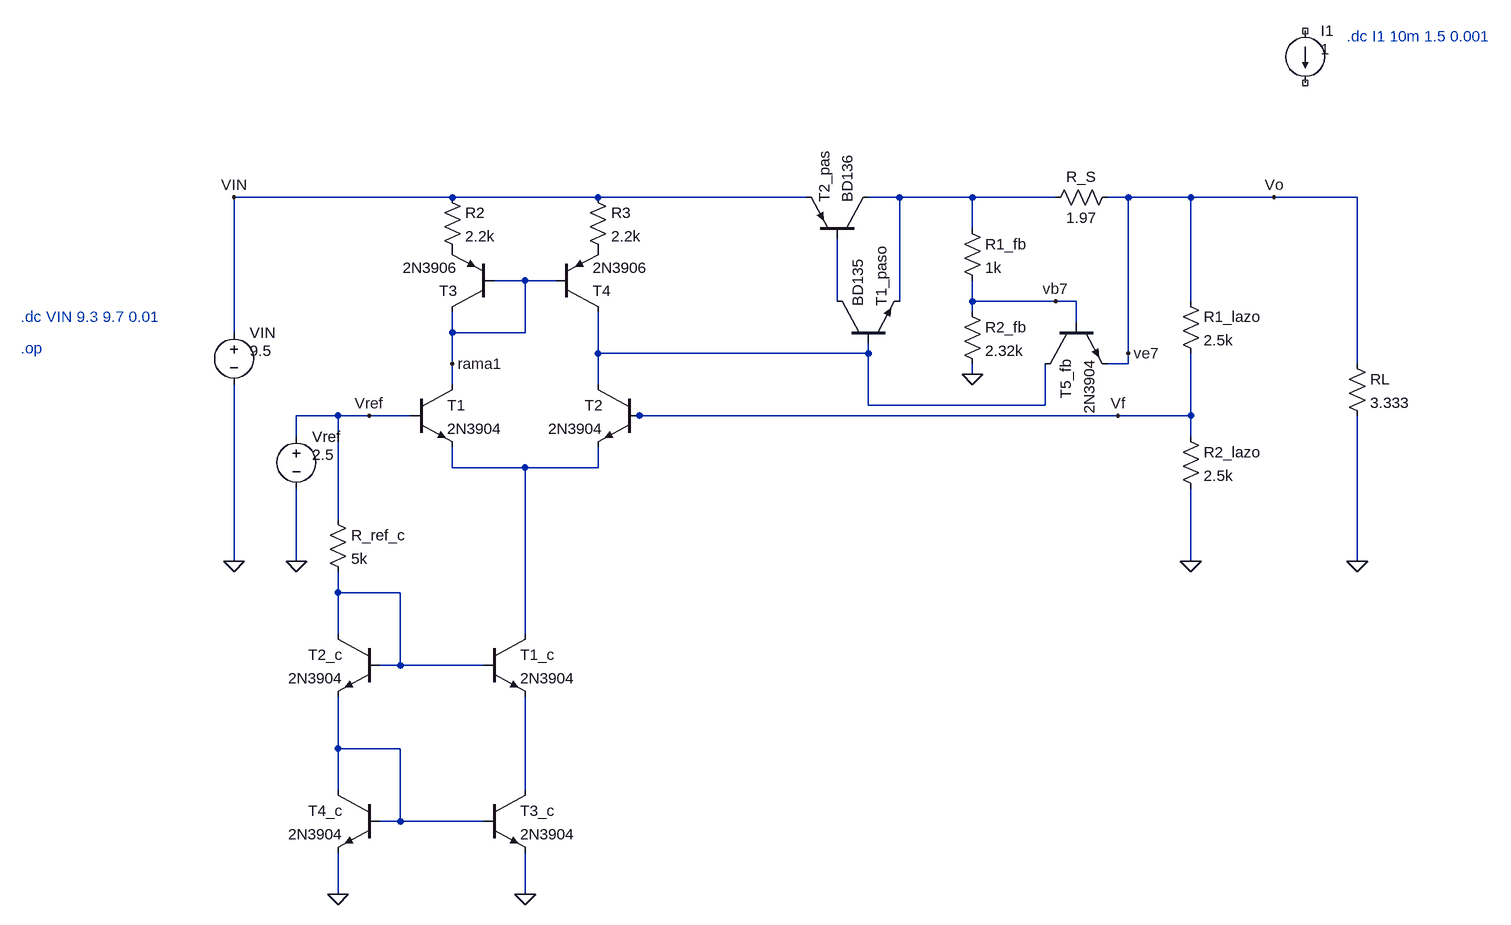
[diagram p0: schematic Circuito_grupo4.asc]
Circuito_grupo4.asc, the LTspice schematic file:
Version 4
SHEET 1 2316 1060
WIRE 96 -32 -240 -32
WIRE 320 -32 96 -32
WIRE 640 -32 320 -32
WIRE 784 -32 736 -32
WIRE 896 -32 784 -32
WIRE 1024 -32 896 -32
WIRE 1136 -32 1104 -32
WIRE 1232 -32 1136 -32
WIRE 1360 -32 1232 -32
WIRE 1488 -32 1360 -32
WIRE 896 16 896 -32
WIRE 208 96 160 96
WIRE 256 96 208 96
WIRE 688 128 688 32
WIRE 784 128 784 -32
WIRE 896 128 896 96
WIRE 1024 128 896 128
WIRE 1056 128 1024 128
WIRE 1232 128 1232 -32
WIRE 896 144 896 128
WIRE 1056 160 1056 128
WIRE -240 176 -240 -32
WIRE 96 176 96 144
WIRE 208 176 208 96
WIRE 208 176 96 176
WIRE 320 208 320 144
WIRE 736 208 736 192
WIRE 736 208 320 208
WIRE 1136 208 1136 -32
WIRE 96 224 96 176
WIRE 1136 224 1136 208
WIRE 1136 224 1104 224
WIRE 1488 224 1488 -32
WIRE 896 240 896 224
WIRE 96 256 96 224
WIRE 320 256 320 208
WIRE 736 288 736 208
WIRE 1008 288 1008 224
WIRE 1008 288 736 288
WIRE -80 304 -144 304
WIRE -32 304 -80 304
WIRE 32 304 -32 304
WIRE 384 304 368 304
WIRE 1120 304 384 304
WIRE 1232 304 1232 208
WIRE 1232 304 1120 304
WIRE -144 336 -144 304
WIRE 1232 336 1232 304
WIRE 96 384 96 352
WIRE 208 384 96 384
WIRE 320 384 320 352
WIRE 320 384 208 384
WIRE -80 464 -80 304
WIRE -240 528 -240 256
WIRE -144 528 -144 416
WIRE 1232 528 1232 416
WIRE 1488 528 1488 304
WIRE -80 576 -80 544
WIRE 16 576 -80 576
WIRE -80 640 -80 576
WIRE 208 640 208 384
WIRE 16 688 16 576
WIRE 16 688 -16 688
WIRE 144 688 16 688
WIRE -80 816 -80 736
WIRE 16 816 -80 816
WIRE -80 880 -80 816
WIRE 208 880 208 736
WIRE 16 928 16 816
WIRE 16 928 -16 928
WIRE 144 928 16 928
WIRE -80 1040 -80 976
WIRE 208 1040 208 976
FLAG 1360 -32 Vo
FLAG -32 304 Vref
FLAG -240 -32 VIN
FLAG 1120 304 Vf
FLAG 896 240 0
FLAG 96 224 rama1
FLAG 1024 128 vb7
FLAG 1136 208 ve7
FLAG -240 528 0
FLAG 1232 528 0
FLAG 1488 528 0
FLAG -144 528 0
FLAG -80 1040 0
FLAG 208 1040 0
DATAFLAG 1200 -32 ""
DATAFLAG 624 304 ""
DATAFLAG 208 384 ""
DATAFLAG 896 -32 ""
SYMBOL pnp 160 144 R180
SYMATTR InstName T3
SYMATTR Value 2N3906
SYMBOL pnp 256 144 M180
SYMATTR InstName T4
SYMATTR Value 2N3906
SYMBOL npn 32 256 R0
SYMATTR InstName T1
SYMATTR Value 2N3904
SYMBOL npn 384 256 M0
SYMATTR InstName T2
SYMATTR Value 2N3904
SYMBOL pnp 736 32 M270
SYMATTR InstName BD136
SYMATTR Value T2_pas
SYMBOL res 1216 112 R0
SYMATTR InstName R1_lazo
SYMATTR Value 2.5k
SYMBOL res 1216 320 R0
SYMATTR InstName R2_lazo
SYMATTR Value 2.5k
SYMBOL voltage -144 320 R0
WINDOW 123 24 124 Left 2
WINDOW 39 0 0 Left 0
WINDOW 3 24 44 Left 2
SYMATTR Value 2.5
SYMATTR InstName Vref
SYMBOL voltage -240 160 R0
WINDOW 123 24 124 Left 2
WINDOW 39 0 0 Left 0
WINDOW 3 24 44 Left 2
SYMATTR Value 9.5
SYMATTR InstName VIN
SYMBOL res 80 -48 R0
SYMATTR InstName R2
SYMATTR Value 2.2k
SYMBOL res 304 -48 R0
SYMATTR InstName R3
SYMATTR Value 2.2k
SYMBOL res 880 0 R0
SYMATTR InstName R1_fb
SYMATTR Value 1k
SYMBOL res 880 128 R0
SYMATTR InstName R2_fb
SYMATTR Value 2.32k
SYMBOL res 1120 -48 R90
WINDOW 0 0 56 VBottom 2
WINDOW 3 32 56 VTop 2
SYMATTR InstName R_S
SYMATTR Value 1.97
SYMBOL npn 1008 160 M90
SYMATTR InstName T5_fb
SYMATTR Value 2N3904
SYMBOL npn 688 192 R270
SYMATTR InstName BD135
SYMATTR Value T1_paso
SYMBOL current 1408 -288 R0
WINDOW 3 24 28 Left 2
WINDOW 123 0 0 Left 0
WINDOW 39 0 0 Left 0
SYMATTR Value 1
SYMATTR InstName I1
SYMBOL res 1472 208 R0
SYMATTR InstName RL
SYMATTR Value 3.333
SYMBOL npn 144 640 R0
SYMATTR InstName T1_c
SYMATTR Value 2N3904
SYMBOL npn -16 640 M0
SYMATTR InstName T2_c
SYMATTR Value 2N3904
SYMBOL npn 144 880 R0
SYMATTR InstName T3_c
SYMATTR Value 2N3904
SYMBOL npn -16 880 M0
SYMATTR InstName T4_c
SYMATTR Value 2N3904
SYMBOL res -96 448 R0
SYMATTR InstName R_ref_c
SYMATTR Value 5k
TEXT 1472 -280 Left 2 ;.dc I1 10m 1.5 0.001
TEXT -568 152 Left 2 ;.dc VIN 9.3 9.7 0.01
TEXT -568 200 Left 2 ;.op

The netlist it stands for:
* Circuito_grupo4.asc
Q§T3 rama1 rama1 P001 0 2N3906
Q§T4 N003 rama1 P002 0 2N3906
Q§T1 rama1 Vref N004 0 2N3904
Q§T2 N003 Vf N004 0 2N3904
Q§BD136 N001 N002 VIN 0 T2_pas
R1_lazo ve7 Vf 2.5k
R2_lazo Vf 0 2.5k
Vref Vref 0 2.5
VIN VIN 0 9.5
R2 VIN P001 2.2k
R3 VIN P002 2.2k
R1_fb N001 vb7 1k
R2_fb vb7 0 2.32k
R_S ve7 N001 1.97
Q§T5_fb N003 vb7 ve7 0 2N3904
Q§BD135 N002 N003 N001 0 T1_paso
I1 NC_01 NC_02 1
RL ve7 0 3.333
Q§T1_c N004 N005 N007 0 2N3904
Q§T2_c N005 N005 N006 0 2N3904
Q§T3_c N007 N006 0 0 2N3904
Q§T4_c N006 N006 0 0 2N3904
R_ref_c Vref N005 5k
.model NPN NPN
.model PNP PNP
.lib standard.bjt
* .dc I1 10m 1.5 0.001
* .dc VIN 9.3 9.7 0.01
* .op
.backanno
.end